# EAGLE schematic SOT23-5 (EAGLE 7.1.0)
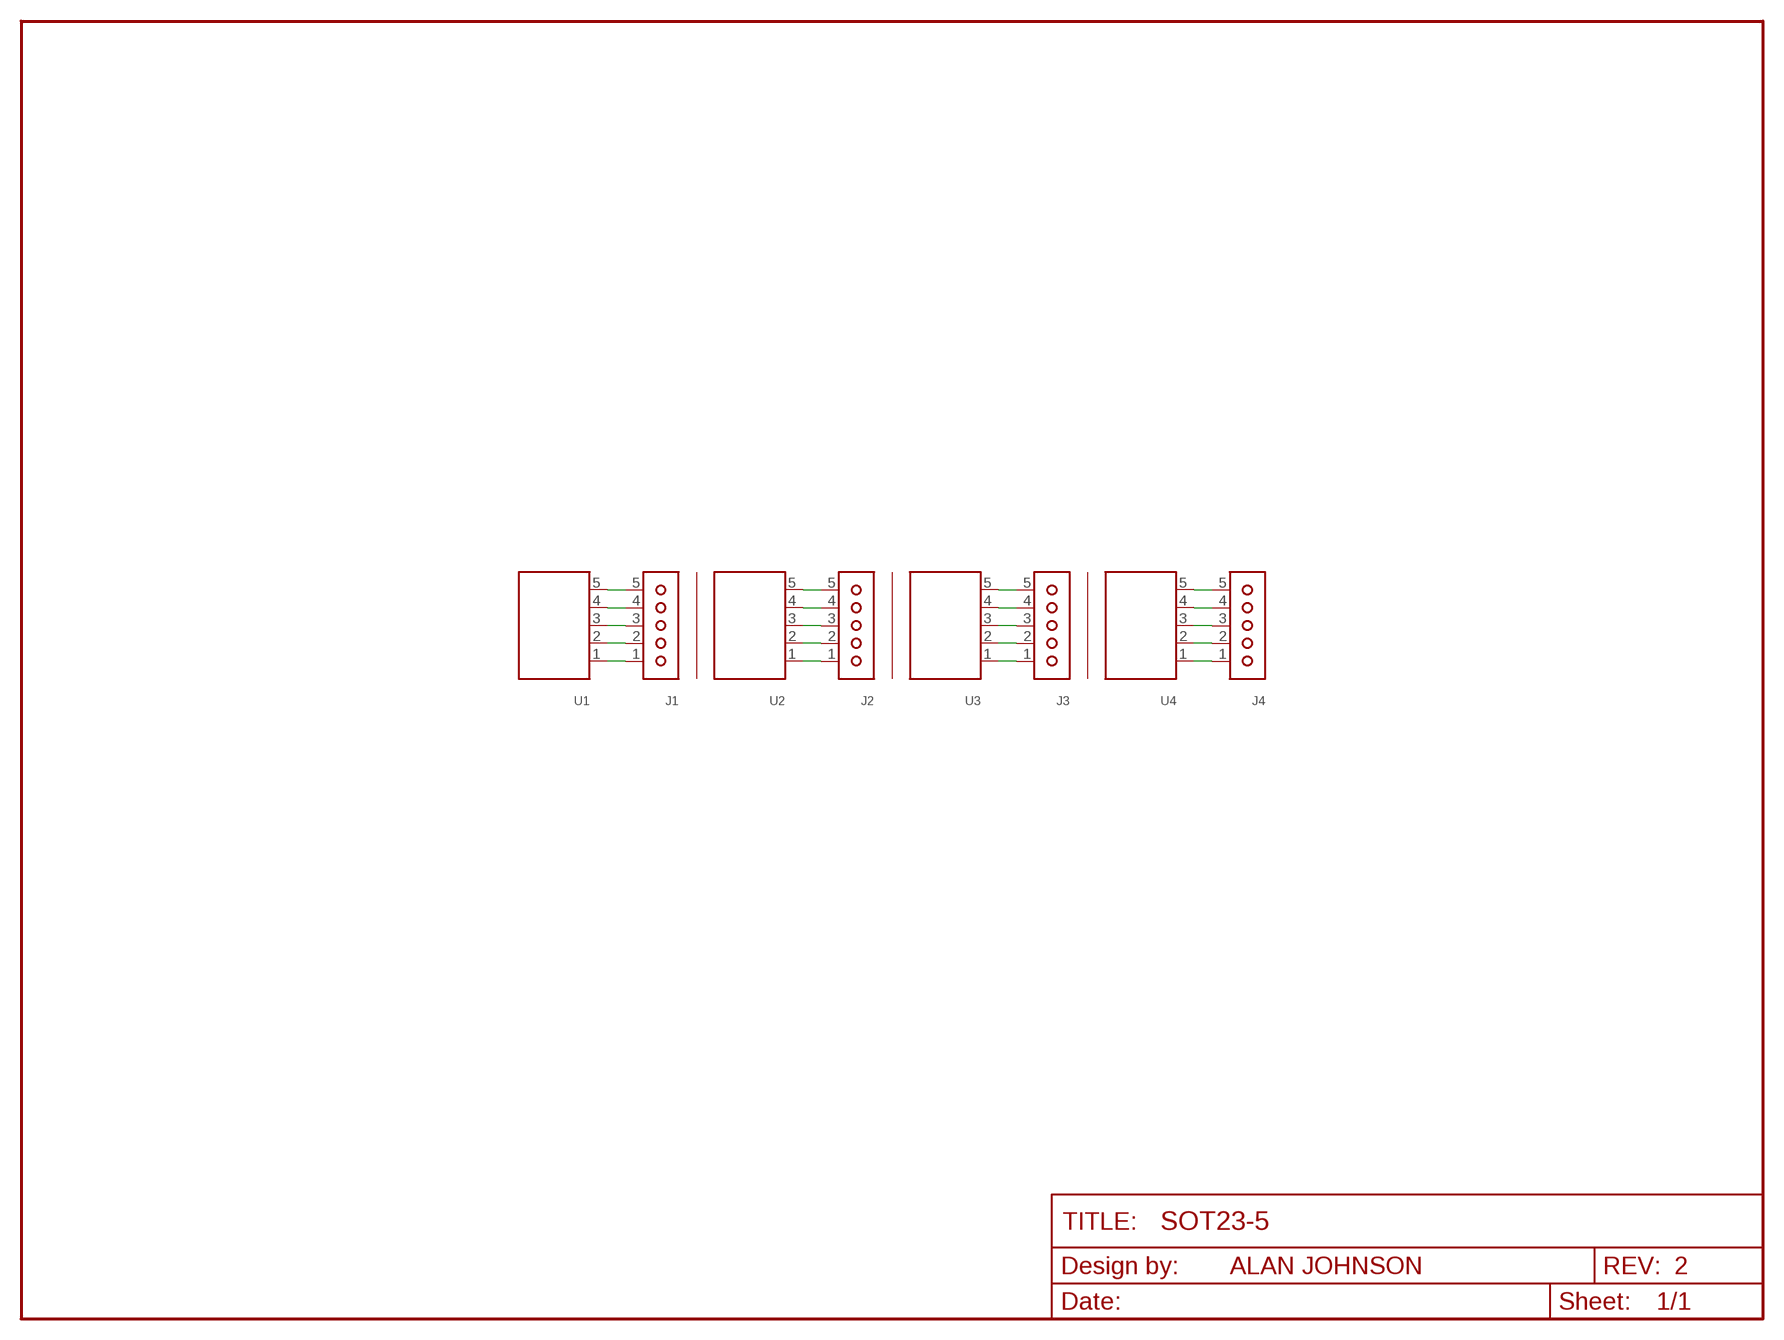
[diagram p0: schematic, sheet 1]

## Parts
J1  1X05  [1X05]
J2  1X05  [1X05]
J3  1X05  [1X05]
J4  1X05  [1X05]
U1  SOT23-5  [SOT23-5]
U2  SOT23-5  [SOT23-5]
U3  SOT23-5  [SOT23-5]
U4  SOT23-5  [SOT23-5]

## Nets
N$1: J1.1 U1.1
N$2: J1.2 U1.2
N$3: J1.3 U1.3
N$4: J2.1 U2.1
N$5: J2.2 U2.2
N$6: J2.3 U2.3
N$7: J3.1 U3.1
N$8: J3.2 U3.2
N$9: J3.3 U3.3
N$10: J4.1 U4.1
N$11: J4.2 U4.2
N$12: J4.3 U4.3
N$22: J1.4 U1.4
N$23: J1.5 U1.5
N$24: J2.4 U2.4
N$25: J2.5 U2.5
N$26: J3.4 U3.4
N$27: J3.5 U3.5
N$28: J4.4 U4.4
N$29: J4.5 U4.5

## Notes on the sheet
- ALAN JOHNSON | 2

## Library data of the parts
J1-J4 = breakouts:1X05: 1x05 Pin Headers
U1-U4 = breakouts:SOT23-5: Small Outline Transistor - 5 Leads